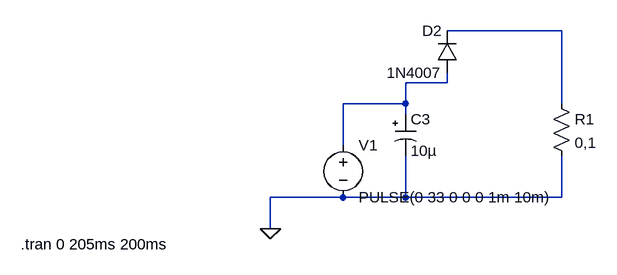
[diagram p0: schematic LM317HC.asc]
LM317HC.asc, the LTspice schematic file:
Version 4
SHEET 1 916 680
WIRE 592 128 416 128
WIRE 416 208 416 192
WIRE 416 208 352 208
WIRE 352 240 352 208
WIRE 352 240 256 240
WIRE 592 240 592 128
WIRE 352 256 352 240
WIRE 256 304 256 240
WIRE 256 384 144 384
WIRE 352 384 352 320
WIRE 352 384 256 384
WIRE 592 384 592 320
WIRE 592 384 352 384
WIRE 144 432 144 384
FLAG 144 432 0
SYMBOL polcap 336 256 R0
WINDOW 3 24 56 Left 2
SYMATTR Value 10µ
SYMATTR InstName C3
SYMATTR Description Capacitor
SYMATTR Type cap
SYMATTR SpiceLine V=50 Irms=1.36931 Rser=0.12 Lser=0 mfg="KEMET" pn="T521D106M050ATE120" type="Tantalum"
SYMBOL diode 432 192 R180
WINDOW 0 24 64 Left 2
WINDOW 3 24 0 Left 2
SYMATTR InstName D2
SYMATTR Value 1N4007
SYMBOL voltage 256 288 R0
WINDOW 123 0 0 Left 0
WINDOW 39 0 0 Left 0
SYMATTR InstName V1
SYMATTR Value PULSE(0 33 0 0 0 1m 10m)
SYMBOL res 576 224 R0
SYMATTR InstName R1
SYMATTR Value 0,1
TEXT -240 456 Left 2 !.tran 0 205ms 200ms

The netlist it stands for:
* LM317HC.asc
C3 N002 0 10µ V=50 Irms=1.36931 Rser=0.12 Lser=0 mfg="KEMET" pn="T521D106M050ATE120" type="Tantalum"
D2 N002 N001 1N4007
V1 N002 0 PULSE(0 33 0 0 0 1m 10m)
R1 N001 0 0,1
.model D D
.lib standard.dio
.tran 0 205ms 200ms
.backanno
.end